# EAGLE board XibecaModule (EAGLE 9.6.2)
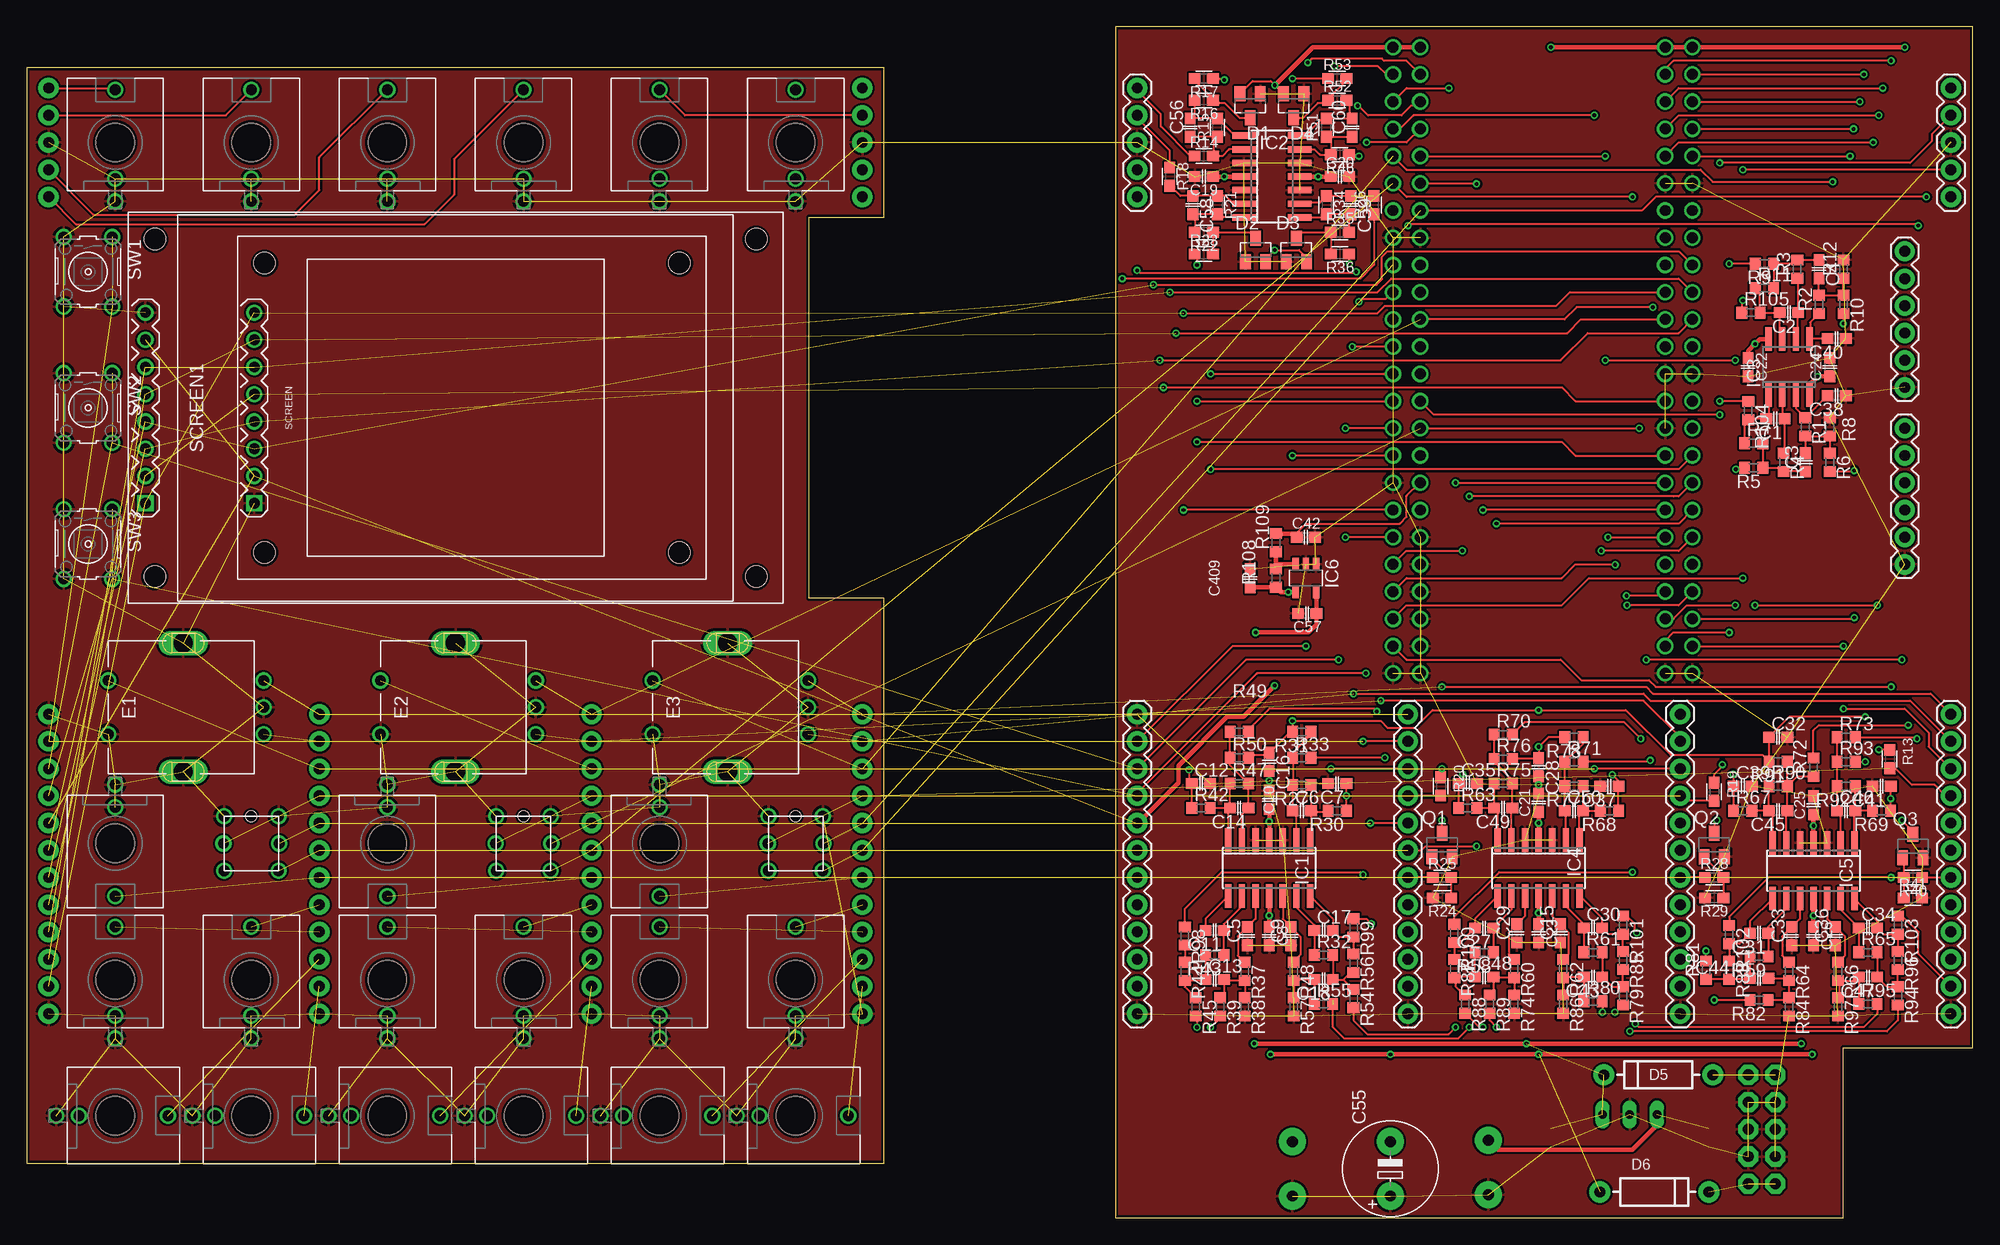
[diagram p2: board, top side]
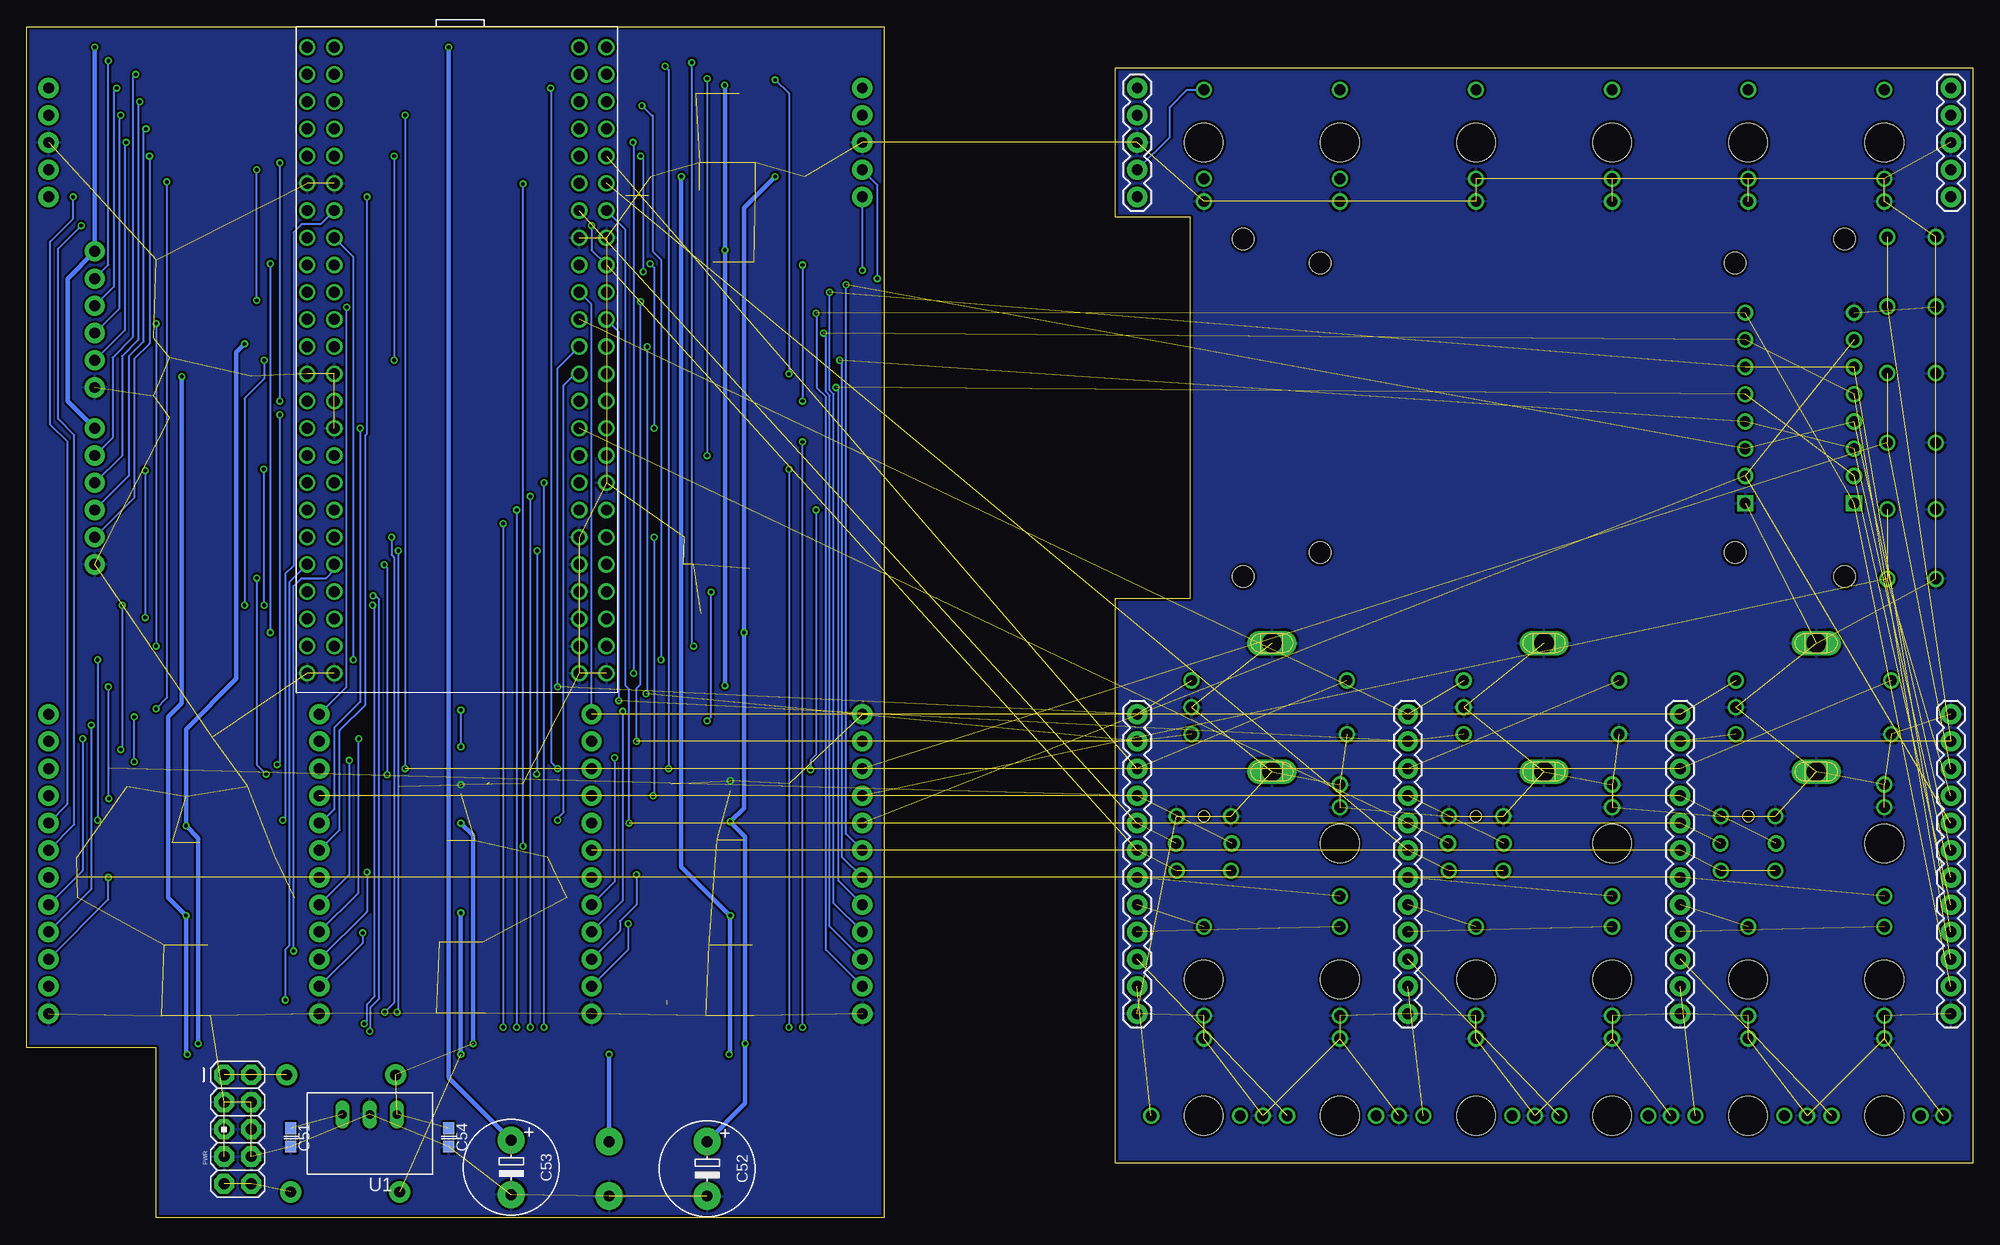
[diagram p3: board, bottom side, seen from below]

Size 181.61 x 111.12 mm. Coordinates in mm from the lower left corner, seen from the top.
Outline: 80.01,93.34 80.01,107.31 0,107.31 0,5.08 80.01,5.08 80.01,57.78 73.03,57.78 73.03,93.34 80.01,93.34
Outline: 101.6,111.12 101.6,0 169.54,0 169.54,15.88 181.61,15.88 181.61,111.12 101.6,111.12
Copper layers (1*16): Top 0.035mm / dielectric 1.5mm / Bottom 0.035mm
Design rules "Fusion_eagle_rule_v1.1": minimum track width 6mil, minimum drill 12mil, track to track 6mil, track to pad 6mil, pad to pad 6mil, via to via 6mil, smd to smd 0mil, copper to edge 10mil, drill to drill 10mil, minimum pad ring 10mil, minimum via ring 6mil, stop-mask expansion 2mil, vias tented up to drill 100mil, thermal gap 10mil
Net classes: 1 power: width 0.178 mm, drill 0.305 mm, clearance 0.178 mm to class 0, clearance 0.178 mm

## Footprints (pad centres in the part's own frame; a part is rotated, then mirrored left to right if it is on the bottom)
C0603 = smd 1.1 x 1: 1 -0.85,0; 2 0.85,0
E5-8,5 = drill 1.016 pad 2.54: + -2.54,0; - 2.54,0
THONKICONN = drill 1: P$1 0,-5.5; P$2 0,-3.38; P$3 0,4.92 | hole 3.6: 0,0
SOT23 = smd 1 x 1.4: 1 -0.95,-1.1; 2 0.95,-1.1; 3 0,1.1
DIODE-1N4001 = drill 1 pad 1.981: A -5.08,0; C 5.08,0
EC12E2424407 = drill 1: C 0,-7.5; PINA -2.5,-7.5; PINB 2.5,-7.5; SWITCH1 -2.5,7; SWITCH2 2.5,7 | drill 1.8 long: P$1 -6,0; P$2 6,0
SO14 = smd 0.6 x 2.2: 1 -3.81,-2.6; 2 -2.54,-2.6; 3 -1.27,-2.6; 4 0,-2.6; 5 1.27,-2.6; 6 2.54,-2.6; 7 3.81,-2.6; 8 3.81,2.6; 9 2.54,2.6; 10 1.27,2.6; 11 0,2.6; 12 -1.27,2.6; 13 -2.54,2.6; 14 -3.81,2.6
SO08 = smd 0.6 x 2.2: 1 -1.905,-2.6; 2 -0.635,-2.6; 3 0.635,-2.6; 4 1.905,-2.6; 5 1.905,2.6; 6 0.635,2.6; 7 -0.635,2.6; 8 -1.905,2.6
SOT23-5 = smd 0.6 x 1.2: 1 -0.95,-1.306; 2 0,-1.306; 3 0.95,-1.306; 4 0.95,1.306; 5 -0.95,1.306
1X05 = drill 1.016 pad 1.88: 1 0,0; 2 2.54,0; 3 5.08,0; 4 7.62,0; 5 10.16,0
1X06 = drill 1.016 pad 1.88: 1 0,0; 2 2.54,0; 3 5.08,0; 4 7.62,0; 5 10.16,0; 6 12.7,0
1X12 = drill 1.016 pad 1.88: 1 0,0; 2 2.54,0; 3 5.08,0; 4 7.62,0; 5 10.16,0; 6 12.7,0; 7 15.24,0; 8 17.78,0; 9 20.32,0; 10 22.86,0; 11 25.4,0; 12 27.94,0
AVR_ICSP = drill 1.016 pad 1.88 octagon: 1 -1.27,5.08; 2 1.27,5.08; 3 -1.27,2.54; 4 1.27,2.54; 5 -1.27,0; 6 1.27,0; 7 -1.27,-2.54; 8 1.27,-2.54; 9 -1.27,-5.08; 10 1.27,-5.08
R0603 = smd 1 x 1.1: 1 -0.85,0; 2 0.85,0
0603 = smd 1.1 x 1: 1 -0.85,0; 2 0.85,0
DISPLAY-TFT-240X320-2.0" = drill 1 square: 1 -8.89,28.93 | drill 1: 2 -6.35,28.93; 3 -3.81,28.93; 4 -1.27,28.93; 5 1.27,28.93; 6 3.81,28.93; 7 6.35,28.93; 8 8.89,28.93 | hole 2: -15.74,28.06; 15.74,28.06; 15.74,-28.06; -15.74,-28.06
DISPLAY-TFT-240X240-1.54" = drill 1 square: 1 -8.89,18.77 | drill 1: 2 -6.35,18.77; 3 -3.81,18.77; 4 -1.27,18.77; 5 1.27,18.77; 6 3.81,18.77; 7 6.35,18.77; 8 8.89,18.77 | hole 2: -13.5,17.81; 13.5,17.81; 13.5,-20.91; -13.5,-20.91
B3F-10XX = drill 1.016: 1 -3.251,2.261; 2 3.251,2.261; 3 -3.251,-2.261; 4 3.251,-2.261
PB6146L = drill 1: P1 -2.54,2.54; P2 2.54,2.54; P3 -2.54,-2.54; P4 2.54,-2.54; PL1 -2.6,0; PL2 2.6,0 | hole 1: 0,2.54
TSR-1-2450 = drill 0.8 long: 1 -2.54,0; 2 0,0; 3 2.54,0
NOCTUA = drill 1.016: 1 13.97,26.67; 2 11.43,26.67; 3 13.97,24.13; 4 11.43,24.13; 5 13.97,21.59; 6 11.43,21.59; 7 13.97,19.05; 8 11.43,19.05; 9 13.97,16.51; 10 11.43,16.51; 11 13.97,13.97; 12 11.43,13.97; 13 13.97,11.43; 14 11.43,11.43; 15 13.97,8.89; 16 11.43,8.89; 17 13.97,6.35; 18 11.43,6.35; 19 13.97,3.81; 20 11.43,3.81; 21 13.97,1.27; 22 11.43,1.27; 23 13.97,-1.27; 24 11.43,-1.27; 25 13.97,-3.81; 26 11.43,-3.81; 27 13.97,-6.35; 28 11.43,-6.35; 29 13.97,-8.89; 30 11.43,-8.89; 31 13.97,-11.43; 32 11.43,-11.43; 33 13.97,-13.97; 34 11.43,-13.97; 35 13.97,-16.51; 36 11.43,-16.51; 37 13.97,-19.05; 38 11.43,-19.05; 39 13.97,-21.59; 40 11.43,-21.59; 41 13.97,-24.13; 42 11.43,-24.13; 43 13.97,-26.67; 44 11.43,-26.67; 45 13.97,-29.21; 46 11.43,-29.21; 47 13.97,-31.75; 48 11.43,-31.75; 49 -11.43,-31.75; 50 -13.97,-31.75; 51 -11.43,-29.21; 52 -13.97,-29.21; 53 -11.43,-26.67; 54 -13.97,-26.67; 55 -11.43,-24.13; 56 -13.97,-24.13; 57 -11.43,-21.59; 58 -13.97,-21.59; 59 -11.43,-19.05; 60 -13.97,-19.05; 61 -11.43,-16.51; 62 -13.97,-16.51; 63 -11.43,-13.97; 64 -13.97,-13.97; 65 -11.43,-11.43; 66 -13.97,-11.43; 67 -11.43,-8.89; 68 -13.97,-8.89; 69 -11.43,-6.35; 70 -13.97,-6.35; 71 -11.43,-3.81; 72 -13.97,-3.81; 73 -11.43,-1.27; 74 -13.97,-1.27; 75 -11.43,1.27; 76 -13.97,1.27; 77 -11.43,3.81; 78 -13.97,3.81; 79 -11.43,6.35; 80 -13.97,6.35; 81 -11.43,8.89; 82 -13.97,8.89; 83 -11.43,11.43; 84 -13.97,11.43; 85 -11.43,13.97; 86 -13.97,13.97; 87 -11.43,16.51; 88 -13.97,16.51; 89 -11.43,19.05; 90 -13.97,19.05; 91 -11.43,21.59; 92 -13.97,21.59; 93 -11.43,24.13; 94 -13.97,24.13; 95 -11.43,26.67; 96 -13.97,26.67

## Placement (x,y rotation side)
C1  220p C0G  [C0603]  163.19,74.55 180 top
C2  220p C0G  [C0603]  164.47,84.45 180 top
C3  1n5  [C0603]  165.99,70.48 90 top
C4  1n5  [C0603]  167.26,88.52 270 top
C5  220p C0G  [C0603]  113.92,26.29 90 top
C6  220p C0G  [C0603]  119,37.97 0 top
C7  22n C0G  [C0603]  122.3,40.51 180 top
C8  100n  [C0603]  115.95,26.29 270 top
C9  220p C0G  [C0603]  117.98,26.29 90 top
C10  100n  [C0603]  115.95,38.99 90 top
C11  220p C0G  [C0603]  110.87,26.8 180 top
C12  22n C0G  [C0603]  109.6,40.51 0 top
C13  1n5  [C0603]  110.87,22.23 0 top
C14  220p C0G  [C0603]  113.16,38.23 180 top
C15  220p C0G  [C0603]  143.13,26.54 90 top
C16  100n  [C0603]  115.95,42.55 270 top
C17  220p C0G  [C0603]  121.03,26.8 0 top
C18  1n5  [C0603]  121.03,22.23 180 top
C19  100n  [C0603]  109.86,97.16 180 top
C20  100n  [C0603]  122.56,97.16 0 top
C21  100n  [C0603]  141.1,38.73 90 top
C22  100n  [C0603]  160.66,79.38 270 top
C23  100n  [C0603]  141.1,26.54 270 top
C24  100n  [C0603]  168.28,79.38 90 top
C25  100n  [C0603]  166.75,38.48 90 top
C26  100n  [C0603]  166.75,26.29 270 top
C27  220p C0G  [C0603]  136.02,27.05 180 top
C28  100n  [C0603]  141.1,42.04 270 top
C29  220p C0G  [C0603]  139.06,26.54 90 top
C30  220p C0G  [C0603]  146.18,27.05 0 top
C31  220p C0G  [C0603]  161.67,26.54 180 top
C32  100n  [C0603]  163.45,44.83 0 top
C33  220p C0G  [C0603]  164.72,26.29 90 top
C34  220p C0G  [C0603]  171.83,27.05 0 top
C35  22n C0G  [C0603]  134.49,40.51 0 top
C36  220p C0G  [C0603]  168.78,26.29 90 top
C37  22n C0G  [C0603]  147.7,40.26 180 top
C38  220p C0G  [C0603]  168.91,76.71 180 top
C39  22n C0G  [C0603]  160.15,40.26 0 top
C40  220p C0G  [C0603]  168.91,82.04 180 top
C41  22n C0G  [C0603]  173.1,40.26 180 top
C42  100n  [C0603]  119.38,63.5 0 top
C43  1n5  [C0603]  146.18,22.48 180 top
C44  1n5  [C0603]  161.67,22.35 0 top
C45  220p C0G  [C0603]  163.45,37.97 180 top
C46  220p C0G  [C0603]  169.8,37.97 0 top
C47  1n5  [C0603]  171.83,22.48 180 top
C48  1n5  [C0603]  136.02,22.48 0 top
C49  220p C0G  [C0603]  137.79,38.23 180 top
C50  220p C0G  [C0603]  144.4,37.97 0 top
C51  100n  [C0603]  156.97,7.49 270 bottom
C52  22u  [E5-8,5]  118.11,4.57 270 bottom
C53  22u  [E5-8,5]  136.4,4.7 270 bottom
C54  100n 16v  [C0603]  142.24,7.49 270 bottom
C55  22u  [E5-8,5]  127.25,4.57 90 top
C56  220p C0G  [C0603]  108.58,101.73 90 top
C57  100n  [C0603]  119.51,56.39 180 top
C58  220p C0G  [C0603]  108.84,94.49 270 top
C59  220p C0G  [C0603]  123.57,94.49 270 top
C60  220p C0G  [C0603]  123.7,101.73 90 top
C409  2u  [C0603]  114.17,59.69 90 top
CV1  THONKICONN  [THONKICONN]  8.26,100.33 0 top
CV2  THONKICONN  [THONKICONN]  20.95,100.33 0 top
CV3  THONKICONN  [THONKICONN]  33.66,100.33 0 top
CV4  THONKICONN  [THONKICONN]  46.35,100.33 0 top
D1  BAT54S  [SOT23]  114.17,103.76 180 top
D2  BAT54S  [SOT23]  114.68,90.3 0 top
D3  BAT54S  [SOT23]  118.49,90.3 0 top
D4  BAT54S  [SOT23]  118.24,103.76 180 top
D5  [DIODE-1N4001]  152.27,13.34 180 top
D6  [DIODE-1N4001]  151.89,2.41 0 top
E1  EC12E2424407  [EC12E2424407]  14.61,47.62 90 top
E2  EC12E2424407  [EC12E2424407]  40.01,47.62 90 top
E3  EC12E2424407  [EC12E2424407]  65.41,47.62 90 top
IC1  OPA1678  [SO14]  115.95,32.64 180 top
IC2  TL074  [SO14]  116.2,97.16 270 top
IC3  TL072D  [SO08]  164.47,79.38 0 top
IC4  OPA1678  [SO14]  141.1,32.64 180 top
IC5  OPA1678  [SO14]  166.75,32.38 180 top
IC6  LMV321ILT  [SOT23-5]  119.38,59.69 180 top
IN1  THONKICONN  [THONKICONN]  8.26,22.23 0 top
IN2  THONKICONN  [THONKICONN]  20.95,22.23 0 top
IN3  THONKICONN  [THONKICONN]  33.66,22.23 0 top
IN4  THONKICONN  [THONKICONN]  46.35,22.23 0 top
IN5  THONKICONN  [THONKICONN]  59.05,22.23 0 top
IN6  THONKICONN  [THONKICONN]  71.75,22.23 0 top
JP1  [1X05]  2.03,95.25 90 bottom
JP2  [1X05]  77.98,95.25 90 bottom
JP3  [1X06]  175.26,90.17 270 top
JP4  [1X06]  175.26,73.66 270 top
JP5  M12PTH  [1X12]  103.63,19.05 90 top
JP6  M12PTH  [1X12]  128.91,19.05 90 top
JP7  M12PTH  [1X12]  154.31,19.05 90 top
JP8  M12PTH  [1X12]  179.58,19.05 90 top
JP9  [1X05]  179.58,95.25 90 top
JP10  M12PTH  [1X12]  77.98,19.05 90 bottom
JP11  M12PTH  [1X12]  52.7,19.05 90 bottom
JP12  M12PTH  [1X12]  27.3,19.05 90 bottom
JP13  M12PTH  [1X12]  2.03,19.05 90 bottom
JP14  [1X05]  103.63,95.25 90 top
OUT1  THONKICONN  [THONKICONN]  59.05,100.33 0 top
OUT2  THONKICONN  [THONKICONN]  71.75,100.33 0 top
OUT3  THONKICONN  [THONKICONN]  8.26,9.53 270 top
OUT4  THONKICONN  [THONKICONN]  20.95,9.53 270 top
OUT5  THONKICONN  [THONKICONN]  33.66,9.53 270 top
OUT6  THONKICONN  [THONKICONN]  46.35,9.53 270 top
OUT7  THONKICONN  [THONKICONN]  59.05,9.53 270 top
OUT8  THONKICONN  [THONKICONN]  71.75,9.53 270 top
PWR  M05X2PTH  [AVR_ICSP]  161.93,8.26 0 bottom
Q1  BC846  [SOT23]  132.08,34.8 0 top
Q2  BC846  [SOT23]  157.48,34.8 0 top
Q3  BC846  [SOT23]  176.02,34.67 0 top
R1  560R  [R0603]  165.99,73.79 270 top
R2  560R  [R0603]  167.26,85.22 90 top
R3  560R  [R0603]  165.23,88.52 90 top
R4  560R  [R0603]  163.96,70.48 270 top
R5  10k  [R0603]  161.16,69.98 180 top
R6  10k  [R0603]  168.28,70.48 270 top
R7  27k  [R0603]  161.16,72.26 0 top
R8  27k  [R0603]  168.28,73.79 90 top
R9  10k  [R0603]  162.18,89.03 180 top
R10  10k  [R0603]  169.54,85.22 270 top
R11  27k  [R0603]  162.18,86.74 0 top
R12  27k  [R0603]  169.54,88.52 90 top
R13  560R  [0603]  173.86,42.8 270 top
R14  100k  [0603]  109.86,99.06 0 top
R15  33k  [0603]  111.12,101.73 90 top
R16  1k  [0603]  109.86,104.27 180 top
R17  100R  [0603]  109.86,106.3 180 top
R18  100k  [0603]  106.68,97.16 270 top
R19  560R  [0603]  157.48,39.75 270 top
R20  560R  [0603]  131.95,40.26 270 top
R21  33k  [0603]  111.12,94.49 270 top
R22  1k  [0603]  109.86,91.95 180 top
R23  100R  [0603]  109.86,89.92 0 top
R24  1M  [0603]  132.08,29.84 180 top
R25  100k  [0603]  132.08,31.75 0 top
R26  100k  [0603]  125.73,94.49 90 top
R27  11k  [R0603]  119,40.39 180 top
R28  100k  [0603]  157.48,31.75 0 top
R29  1M  [0603]  157.48,29.84 180 top
R30  47R  [R0603]  122.3,37.97 180 top
R31  11k  [R0603]  119,45.34 180 top
R32  560R  [R0603]  121.03,24.51 0 top
R33  100k  [R0603]  119,42.93 0 top
R34  33k  [0603]  121.28,94.49 270 top
R35  1k  [0603]  122.56,91.95 0 top
R36  100R  [0603]  122.56,89.92 180 top
R37  560R  [R0603]  113.67,22.99 270 top
R38  27k  [R0603]  113.67,19.68 270 top
R39  10k  [R0603]  111.38,19.68 270 top
R40  100k  [0603]  176.02,31.75 180 top
R41  1M  [0603]  176.02,29.84 0 top
R42  47R  [R0603]  109.6,38.23 0 top
R43  560R  [R0603]  110.87,24.51 180 top
R44  27k  [R0603]  108.08,22.99 270 top
R45  10k  [R0603]  109.09,19.68 270 top
R46  100k  [0603]  122.56,99.19 180 top
R47  11k  [R0603]  113.16,40.51 0 top
R48  560R  [R0603]  118.24,22.99 270 top
R49  100k  [R0603]  113.16,45.34 0 top
R50  11k  [R0603]  113.16,42.93 0 top
R51  33k  [0603]  121.28,101.73 90 top
R52  1k  [0603]  122.3,104.27 0 top
R53  100R  [0603]  122.3,106.3 0 top
R54  10k  [R0603]  123.83,20.45 270 top
R55  10k  [R0603]  121.03,19.94 0 top
R56  27k  [R0603]  123.83,23.75 270 top
R57  27k  [R0603]  118.24,19.68 270 top
R58  560R  [R0603]  136.02,24.77 180 top
R59  560R  [R0603]  161.67,24.38 180 top
R60  560R  [R0603]  138.81,23.24 270 top
R61  560R  [R0603]  146.18,24.77 0 top
R62  560R  [R0603]  143.38,23.24 270 top
R63  47R  [R0603]  134.49,38.23 0 top
R64  560R  [R0603]  164.47,22.99 270 top
R65  560R  [R0603]  171.83,24.77 0 top
R66  560R  [R0603]  169.04,22.99 270 top
R67  47R  [R0603]  160.15,37.97 0 top
R68  47R  [R0603]  147.7,37.97 180 top
R69  47R  [R0603]  173.1,37.97 180 top
R70  100k  [R0603]  137.79,45.09 0 top
R71  100k  [R0603]  144.4,42.55 0 top
R72  100k  [R0603]  166.75,42.04 90 top
R73  100k  [R0603]  169.8,44.83 0 top
R74  27k  [R0603]  138.81,19.94 270 top
R75  11k  [R0603]  137.79,40.51 0 top
R76  11k  [R0603]  137.79,42.8 0 top
R77  11k  [R0603]  144.4,40.26 180 top
R78  11k  [R0603]  144.4,44.83 180 top
R79  10k  [R0603]  148.97,20.7 270 top
R80  10k  [R0603]  146.18,20.19 0 top
R81  10k  [R0603]  156.72,23.11 90 top
R82  10k  [R0603]  161.67,20.32 180 top
R83  27k  [R0603]  158.88,23.11 270 top
R84  27k  [R0603]  164.47,19.68 270 top
R85  27k  [R0603]  148.97,24 270 top
R86  27k  [R0603]  143.38,19.94 270 top
R87  27k  [R0603]  133.22,23.24 270 top
R88  10k  [R0603]  134.24,19.94 270 top
R89  10k  [R0603]  136.53,19.94 270 top
R90  11k  [R0603]  163.45,40.26 0 top
R91  11k  [R0603]  163.45,42.55 180 top
R92  11k  [R0603]  169.8,40.26 180 top
R93  11k  [R0603]  169.8,42.55 0 top
R94  10k  [R0603]  174.62,20.7 270 top
R95  10k  [R0603]  171.83,19.94 0 top
R96  27k  [R0603]  174.62,24 270 top
R97  27k  [R0603]  169.04,19.68 270 top
R98  100R  [R0603]  108.08,26.29 270 top
R99  100R  [R0603]  123.83,27.05 270 top
R100  100R  [R0603]  133.22,26.54 270 top
R101  100R  [R0603]  148.97,27.3 270 top
R102  100R  [R0603]  158.88,26.42 270 top
R103  100R  [R0603]  174.62,27.3 270 top
R104  100R  [R0603]  160.66,75.31 270 top
R105  100R  [R0603]  160.91,84.45 0 top
R108  1M  [R0603]  116.59,59.69 90 top
R109  1M  [R0603]  116.59,62.99 90 top
SCREEN  DISPLAY-TFT-240X2402.0  [DISPLAY-TFT-240X320-2.0"]  40.01,75.56 90 top
SCREEN1  DISPLAY-TFT-240X2401.54  [DISPLAY-TFT-240X240-1.54"]  40.01,75.56 90 top
SW1  [B3F-10XX]  5.71,88.27 270 top
SW2  [B3F-10XX]  5.71,75.56 270 top
SW3  [B3F-10XX]  5.71,62.87 270 top
SW4  PB6146L  [PB6146L]  20.95,34.92 0 top
SW5  PB6146L  [PB6146L]  46.35,34.92 0 top
SW6  PB6146L  [PB6146L]  71.75,34.92 0 top
TR1  THONKICONN  [THONKICONN]  8.26,34.92 180 top
TR2  THONKICONN  [THONKICONN]  33.66,34.92 180 top
TR3  THONKICONN  [THONKICONN]  59.05,34.92 180 top
U1  [TSR-1-2450]  149.61,9.65 180 bottom
U$2  NOCTUA2NOCTUA2  [NOCTUA]  141.48,82.55 0 bottom

## Tracks (layer width: path | path; a pad name or v marks a point on that pad's centre or on a via)
+3V3  (via drill 0.35)  (3 unrouted)
  Top 0.203: D2.2 115.63,89.47 v116.46,90.3 118.75,90.3 119.44,89.6 D3.2 | D1.2 114.41,106.05 116.1,106.05 v116.47,105.67 D4.2
  Top 0.406: v116.46,49.66 113.54,46.74 112.01,46.74 107.47,42.19 107.47,40.61 103.69,36.83 JP5.8 | U$2.2 U$2.1 120.02,109.22 v116.47,105.67
  Bottom 0.203: 116.46,105.66 v116.47,105.67
  Bottom 0.406: 116.46,105.66 v116.46,90.3 v116.46,49.66
+5V  (via drill 0.35)  (1 unrouted)
  Top 0.406: v175.26,109.22 U$2.96 U$2.95 v142.24,109.22 | U1.3 152.15,8.64 149.86,6.35 137.29,6.35 C53.+
  Bottom 0.406: v175.26,109.22 JP3.1 177.8,87.63 177.8,76.2 JP4.1 | C53.+ 142.24,13.08 v142.24,109.22
+12V  (via drill 0.35)  (3 unrouted)
  Top 0.406: IC1.4 v115.95,36.96 C10.1 | C21.1 v141.1,36.83 IC4.4 | IC5.4 v166.75,36.58 C25.1 | v114.55,16.26 v139.95,16.26 v165.61,16.26 | IC3.8 161.73,81.97 v161.29,81.53 160.66,80.9 C22.1 | IC2.4 v111.76,97.16 C19.1 | v114.68,54.61 119.63,54.61 120.36,55.33 C57.1 120.36,58.36 IC6.5
  Bottom 0.406: C52.+ 114.55,10.67 v114.55,16.26 114.55,35.56 v115.95,36.96 114.68,38.23 v114.68,54.61 114.68,94.23 v111.76,97.16 | v165.61,16.26 165.61,35.43 v166.75,36.58 166.75,45.59 162.05,50.29 162.05,80.77 v161.29,81.53 | v141.1,36.83 139.95,35.69 v139.95,16.26
-12V  (via drill 0.35)  (1 unrouted)
  Top 0.406: IC1.11 v115.95,28.19 C8.1 | IC4.11 v141.1,28.45 C23.1 | IC5.11 v166.75,28.19 C26.1 | v166.62,15.24 v141.1,15.24 v127.25,15.24 v116.08,15.24 | C24.1 167.17,78.53 v167.13,78.49 166.37,77.72 IC3.4 | IC2.11 v120.52,97.16 C20.1
  Bottom 0.406: C55.- v127.25,15.24 | v166.62,15.24 166.75,15.37 v166.75,28.19 168.4,29.84 168.4,46.74 167.13,48.01 v167.13,78.49 | v141.1,28.45 v141.1,15.24 | v116.08,15.24 115.95,15.37 v115.95,28.19 120.52,32.77 v120.52,97.16
ADC1  (via drill 0.35)
  Top 0.203: R17.1 111.63,106.3 v111.76,106.17 | v110.49,78.74 U$2.25
  Bottom 0.203: v111.76,106.17 110.49,104.9 v110.49,78.74
ADC2  (via drill 0.35)
  Top 0.203: R23.1 109.22,89.7 v109.22,88.9 | v109.22,76.2 U$2.27
  Bottom 0.203: v109.22,88.9 v109.22,76.2
ADC3  (via drill 0.35)
  Top 0.203: R36.1 123.41,89.07 v123.44,89.03 | U$2.29 v123.06,73.66
  Bottom 0.203: v123.44,89.03 123.06,88.65 v123.06,73.66
ADC4  (via drill 0.35)
  Top 0.203: U$2.31 v118.11,71.12 | R53.1 v118.11,106.3
  Bottom 0.203: v118.11,106.3 v118.11,71.12
ADCREF
  Top 0.203: C42.1 118.53,63.92 119.38,64.77 128.14,64.77 128.78,65.41 128.78,67.35 130.01,68.58 U$2.34
  Top 0.406: R109.2 118.19,63.84 C42.1
ADCREF_NEGATIVE  (via drill 0.35)
  Top 0.203: 117.94,45.34 R31.2 118.15,45.59 | 118.15,45.59 118.15,46.32 v118.11,46.35 126.36,46.35 127,45.72 129.54,45.72 131.19,47.37 v141.1,47.37 149.22,47.37 153.42,43.18 161.96,43.18 R91.2 C32.1 164.5,46.74 v171.58,46.74 | R93.2 v171.58,42.55 | R76.2 138.73,42.89 C28.1 v141.1,43.94 141.99,44.83 R78.2 | R50.2 114.3,43.22 115.82,43.22 C16.1 118.15,45.59
  Top 0.406: IC6.4 v117.73,58.38 117.04,58.38 R108.1 C409.1
  Bottom 0.203: v118.11,46.35 117.73,46.74 v117.73,58.38 | v171.58,42.55 v171.58,46.74 | v141.1,47.37 v141.1,43.94
AIN1P  (via drill 0.35)
  Top 0.203: R42.1 C12.1 108.46,40.81 v108.46,41.78 | U$2.35 v107.95,66.04
  Bottom 0.203: v107.95,66.04 107.95,43.18 108.46,42.67 v108.46,41.78
AIN2P  (via drill 0.35)
  Top 0.203: R30.1 v123.15,39.37 C7.1 | U$2.37 v123.06,63.5
  Bottom 0.203: v123.06,63.5 123.06,39.46 v123.15,39.37
AIN3P  (via drill 0.35)
  Top 0.203: R63.1 C35.1 134.04,40.91 v134.04,41.4 | U$2.39 128.78,62.23 v133.99,62.23
  Bottom 0.203: v133.99,62.23 133.99,41.46 v134.04,41.4
AIN4P  (via drill 0.35)
  Top 0.203: R68.1 C37.1 148.55,40.76 v147.98,41.33 | U$2.41 128.78,59.69 143.26,59.69 144.53,60.96 147.96,60.96 147.99,60.93 v148.24,60.93
  Bottom 0.203: v148.24,60.93 147.98,60.67 v147.98,41.33
AIN5P  (via drill 0.35)
  Top 0.203: R67.1 C39.1 159.26,40.3 v159.26,41.4 | U$2.43 128.78,57.15 143.26,57.15 145.8,59.69 v160.15,59.69
  Bottom 0.203: v160.15,59.69 160.15,42.29 v159.26,41.4
AIN6P  (via drill 0.35)
  Top 0.203: R69.1 v173.95,39.12 C41.1 | U$2.45 128.78,52.07 143.17,52.07 145.07,50.16 151.38,50.16 152.02,49.53 v173.99,49.53
  Bottom 0.203: v173.99,49.53 173.99,39.16 v173.95,39.12
AOUT1_N  (via drill 0.35)
  Top 0.203: U$2.66 154.18,69.85 v110.49,69.85 | v110.49,17.78 111.38,18.67 R39.2
  Bottom 0.203: v110.49,69.85 v110.49,17.78
AOUT1_P  (via drill 0.35)
  Top 0.203: R45.2 109.22,18.71 v109.22,17.78 | v109.22,72.39 143.26,72.39 144.53,71.12 U$2.65
  Bottom 0.203: v109.22,17.78 v109.22,72.39
AOUT2_N  (via drill 0.35)  (1 unrouted)
  Top 0.203: U$2.64 154.18,67.31 153.67,67.31 v134.62,67.31 | v134.62,17.78 133.55,16.71 133.35,16.71 122.99,16.71 121.92,17.78 121.92,20.32
  Bottom 0.203: v134.62,67.31 v134.62,17.78
AOUT2_P  (via drill 0.35)
  Top 0.203: R54.2 123.83,18.41 125.09,17.14 132.72,17.14 v133.35,17.78 | v133.35,68.58 U$2.63
  Bottom 0.203: v133.35,17.78 v133.35,68.58
AOUT3_N  (via drill 0.35)
  Top 0.203: U$2.62 154.18,64.77 v137.16,64.77 | v137.16,17.78 136.53,18.41 R89.2
  Bottom 0.203: v137.16,64.77 v137.16,17.78
AOUT3_P  (via drill 0.35)
  Top 0.203: U$2.61 v135.89,66.04 | v135.89,17.78 135.55,17.78 R88.2
  Bottom 0.203: v135.89,66.04 v135.89,17.78
AOUT4_N  (via drill 0.35)
  Top 0.203: R80.2 147.03,19.22 v147.07,19.18 | U$2.60 154.18,62.23 v146.94,62.23
  Bottom 0.203: v147.07,19.18 146.94,19.3 v146.94,62.23
AOUT4_P  (via drill 0.35)
  Top 0.203: R79.2 148.3,19.18 v148.21,19.18 | v147.57,63.5 U$2.59
  Bottom 0.203: v147.57,63.5 147.57,61.85 147.32,61.59 147.32,20.07 v148.21,19.18
AOUT5_N  (via drill 0.35)
  Top 0.203: R82.2 v157.48,20.32
  Bottom 0.203: v157.48,20.32 157.48,25.02 157.1,25.4 157.1,59.31 U$2.58
AOUT5_P  (via drill 0.35)
  Top 0.203: R81.2 v156.72,24.89
  Bottom 0.203: U$2.57 152.91,60.45 153.67,59.69 155.96,59.69 156.72,58.93 v156.72,24.89
AOUT6_N  (via drill 0.35)
  Top 0.203: R95.2 172.68,19.09 172.72,19.05 171.45,17.78 150.44,17.78 v150.11,18.11 | U$2.56 154.18,57.15 v149.35,57.15
  Bottom 0.203: v150.11,18.11 149.86,18.36 149.86,19.94 149.12,20.68 149.12,56.92 v149.35,57.15
AOUT6_P  (via drill 0.35)
  Top 0.203: R94.2 174.62,18.41 173.61,17.4 v149.61,17.4 | U$2.55 152.53,58.04 v149.3,58.04
  Bottom 0.203: v149.61,17.4 149.5,17.5 149.5,19.66 148.72,20.45 148.72,57.71 149.05,58.04 v149.3,58.04
AOUT7_N  (via drill 0.35)
  Top 0.203: R6.2 170.47,69.64 v170.56,69.72 | U$2.54 170.43,55.88 v170.56,56.01
  Bottom 0.203: v170.56,69.72 v170.56,56.01
AOUT7_P  (via drill 0.35)
  Top 0.203: U$2.53 153.67,55.88 154.94,57.15 v159.46,57.15 | v159.51,69.85 159.64,69.98 R5.2
  Bottom 0.203: v159.46,57.15 159.46,69.8 v159.51,69.85
AOUT8_N  (via drill 0.35)
  Top 0.203: R10.2 v169.54,83.44 | U$2.52 v169.54,53.34
  Bottom 0.203: v169.54,83.44 v169.54,53.34
AOUT8_P  (via drill 0.35)
  Top 0.203: U$2.51 152.91,53.85 153.67,54.61 v158.88,54.61 | R9.2 v158.88,89.03
  Bottom 0.203: v158.88,89.03 v158.88,54.61
CV1
  Top 0.203: JP14.5 103.63,105.19 105.84,102.98 105.84,101.84 108.62,99.06 R14.1
CV2
  Top 0.203: JP14.4 103.63,102.62 106.68,99.57 R18.1
CV3  (via drill 0.35)
  Top 0.203: R26.1 125.73,88.9 124.46,87.63 v102.23,87.63
  Bottom 0.203: JP14.2 102.23,96.39 v102.23,87.63
CV4  (via drill 0.35)
  Top 0.203: R46.1 124.21,99.19 v124.33,99.06 | v124.08,88.27 123.95,88.14 103.89,88.14 v103.63,88.39
  Bottom 0.203: v124.33,99.06 124.08,98.81 v124.08,88.27 | v103.63,88.39 JP14.1
ENC1A  (via drill 0.35)  (2 unrouted)
  Top 0.203: JP6.11 v124.71,44.45 | v124.33,85.47 124.61,85.75 126.85,85.75 127.46,86.36 U$2.19
  Bottom 0.203: v124.71,44.45 124.71,49.4 124.33,49.78 v124.33,85.47
ENC1B  (2 unrouted)
  Bottom 0.203: JP6.12 128.91,85.22 U$2.20
ENC1SW  (via drill 0.35)  (2 unrouted)
  Top 0.203: JP6.10 v121.72,41.91 | v122.05,107.44 126.11,107.44 126.87,106.68 U$2.3
  Bottom 0.203: v121.72,41.91 121.72,107.11 v122.05,107.44
ENC2A  (via drill 0.35)  (2 unrouted)
  Top 0.203: JP7.11 154.31,44.83 150.88,48.26 v126.36,48.26
  Bottom 0.203: U$2.21 126.36,82.68 v126.36,48.26
ENC2B  (via drill 0.35)  (2 unrouted)
  Top 0.203: v151.76,84.96 144.65,84.96 143.51,83.82 U$2.22
  Bottom 0.203: JP7.12 151.76,49.53 v151.76,84.96
ENC2SW  (via drill 0.35)  (2 unrouted)
  Top 0.203: JP7.10 v146.3,41.91 | v146.3,102.87 129.41,102.87 128.14,101.6 U$2.7
  Bottom 0.203: v146.3,102.87 v146.3,41.91
ENC3A  (via drill 0.35)  (2 unrouted)
  Top 0.203: U$2.23 v123.7,81.28 | v123.83,48.9 150.88,48.9 151.51,48.26 175.77,48.26 JP8.11
  Bottom 0.203: v123.7,81.28 123.7,49.02 v123.83,48.9
ENC3B  (via drill 0.35)  (2 unrouted)
  Top 0.203: v132.08,49.53 151.13,49.53 151.76,48.9 177.67,48.9 JP8.12
  Bottom 0.203: v132.08,49.53 132.08,79.25 U$2.24
ENC3SW  (via drill 0.35)  (2 unrouted)
  Top 0.203: U$2.9 128.78,97.79 156.21,97.79 157.35,96.65 v168.53,96.65 | v169.54,47.5 175.26,47.5 177.5,45.26 177.5,43.96 179.54,41.91 JP8.10
  Bottom 0.203: v168.53,96.65 168.53,48.51 v169.54,47.5
GND  (via drill 0.35)  (162 unrouted)
  Top 0.203: C28.2 v141.1,40.39 C21.2 | C16.2 v115.95,40.77 C10.2
  pour Top (isolate 0.2): -2.24,123.83 85.65,123.83 85.65,-3.17 -2.24,-3.17
  pour Bottom (isolate 0.2): -7.92,118.75 83.34,118.75 83.34,-8.26 -7.92,-8.26
  pour Bottom (isolate 0.2): 94.95,118.75 186.21,118.75 186.21,-8.26 94.95,-8.26
  pour Top (isolate 0.2): 99.36,123.83 199.39,123.83 199.39,-3.17 99.36,-3.17
IN1  (via drill 0.35)
  Top 0.203: v125.98,47.24 125.73,47.5 115.95,47.5 114.01,45.55 R49.2
  Bottom 0.203: v125.98,47.24 125.98,29.59 JP6.4
IN2  (via drill 0.35)
  Top 0.203: v126.75,42.93 R33.2
  Bottom 0.203: JP6.5 126.75,31.37 v126.75,42.93
IN3  (via drill 0.35)
  Top 0.203: v150.62,44.7 149.1,46.23 139.79,46.23 R70.2
  Bottom 0.203: v150.62,44.7 150.68,44.65 150.68,30.3 JP7.4
IN4  (via drill 0.35)
  Top 0.203: R71.2 151.38,42.55 v151.51,42.67
  Bottom 0.203: v151.51,42.67 151.51,32 JP7.5
IN5  (via drill 0.35)
  Top 0.203: R72.2 166.75,45.47 167.26,45.97 v175.59,45.97
  Bottom 0.203: v175.59,45.97 175.59,30.66 JP8.4
IN6  (via drill 0.35)
  Top 0.203: R73.2 176.28,44.83 v176.4,44.7
  Bottom 0.203: v176.4,44.7 176.4,32.38 JP8.5
LEDSW4  (via drill 0.35)
  Top 0.203: U$2.5 128.78,105.41 v132.72,105.41 | v132.08,41.91 132.08,41.24 R20.1
  Bottom 0.203: v132.72,105.41 132.66,105.36 132.66,42.49 v132.08,41.91
LEDSW4A  (2 unrouted)
  Top 0.203: R20.2 131.91,39.37 JP6.9
LEDSW4C  (via drill 0.35)  (2 unrouted)
  Top 0.203: JP6.8 v125.4,36.83
  Bottom 0.203: v125.4,36.83 125.4,49.33 125.73,49.66 125.73,92.2 U$2.13
LEDSW5  (via drill 0.35)
  Top 0.203: R19.1 157.48,41.36 158.24,42.12 v158.24,42.29 | v157.99,74.93 131.32,74.93 U$2.28
  Bottom 0.203: v157.99,74.93 157.99,42.55 v158.24,42.29
LEDSW5A  (2 unrouted)
  Top 0.203: R19.2 154.77,38.9 JP7.9
LEDSW5C  (via drill 0.35)  (2 unrouted)
  Top 0.203: U$2.30 v150.5,73.66
  Bottom 0.203: JP7.8 154.18,36.83 152.91,38.1 152.91,45.72 150.5,48.13 v150.5,73.66
LEDSW6  (via drill 0.35)
  Top 0.203: R13.1 172.89,43.65 v172.85,43.69 | U$2.10 v147.32,99.06 | v147.32,80.01 v159.46,80.01 | v161.29,57.15 v172.72,57.15
  Bottom 0.203: v172.85,43.69 172.72,43.81 v172.72,57.15 | v147.32,99.06 v147.32,80.01 | v159.46,80.01 159.46,78.29 161.29,76.45 v161.29,57.15
LEDSW6A  (2 unrouted)
  Top 0.203: JP8.9 179.07,39.37 178.05,40.39 175.93,40.39 174.37,41.95 R13.2
LEDSW6C  (via drill 0.35)  (2 unrouted)
  Top 0.203: v177.29,95.25 152.02,95.25 150.75,93.98 U$2.14
  Bottom 0.203: JP8.8 177.8,38.61 177.8,72.39 179.43,74.02 179.43,91.08 177.29,93.22 v177.29,95.25
N$1
  Top 0.203: IC1.14 121.88,27.92 C17.2 122.48,26.2 R99.2 R56.1
N$2
  Top 0.203: R57.1 R48.2 118.33,22.23 C18.2 R55.1
N$3
  Top 0.203: R32.2 C18.1 122.9,22.23 | R54.1 122.9,22.23 | R56.2 123.57,22.9 122.9,22.23
N$4
  Top 0.203: R27.1 C6.2 119.85,37.85 | 119.85,37.85 119.85,35.33 IC1.1 | R30.2 121.32,37.85 119.85,37.85
N$5
  Top 0.203: IC1.13 118.49,29 120.18,27.3 C17.1 R32.1
N$6
  Top 0.203: IC1.2 118.49,37.63 C6.1 R27.2 R33.1 118.15,43.38 119.85,45.09 R31.1
N$7  (2 unrouted)
N$8
  Top 0.203: IC1.12 117.22,27.9 C9.2 117.98,27.1 118.86,26.22 118.86,24.53 118.24,23.9 R48.1
N$9  (2 unrouted)
N$10
  Top 0.203: IC5.14 172.68,27.66 C34.2 173.28,26.45 R103.2 R96.1
N$11
  Top 0.203: R89.1 136.87,21.13 C48.2 136.96,22.39 R60.2 R74.1
N$12
  Top 0.203: R58.2 C48.1 133.44,22.48 133.35,22.39 R87.2 133.35,22.26 133.35,21.59 134.15,20.79 R88.1
N$13
  Top 0.203: IC4.9 138.56,28.74 C27.1 R58.1
N$14
  Top 0.203: IC4.10 139.83,28.16 C29.2 139.06,27.3 138.31,26.55 138.31,24.59 R60.1
N$15
  Top 0.203: IC4.8 135.17,27.92 C27.2 133.81,25.69 R100.2 R87.1
N$16
  Top 0.203: R85.1 R101.2 147.62,26.45 C30.2 147.03,27.94 144.93,30.04 IC4.14
N$17
  Top 0.203: IC4.7 137.29,37.88 C49.2 | C49.2 R75.1 | C49.2 R63.2
N$18  (1 unrouted)
  Top 0.203: IC4.6 138.56,38.14 C49.1 R75.2 | 138.43,40.64 138.43,41.06 136.94,42.55 R76.1 R70.1
N$19  (1 unrouted)
N$20
  Top 0.203: IC4.1 144.91,37.63 C50.2 | C50.2 R68.2 | C50.2 R77.1
N$21
  Top 0.203: IC4.2 143.64,37.88 C50.1 R77.2 R71.1 145.25,44.24 R78.1
N$22
  Top 0.203: IC5.8 160.82,27.66 C31.2 159.84,25.57 R102.2 R83.1
N$23
  Top 0.203: R80.1 C43.2 143.47,22.48 R62.2 R86.1
N$24
  Top 0.203: R61.2 C43.1 147.96,21.55 R79.1 R85.2
N$25
  Top 0.203: IC4.13 143.64,29.08 145.33,27.39 C30.1 R61.1
N$26
  Top 0.203: IC4.12 142.37,28.16 C15.2 143.88,26.64 143.88,24.59 R62.1
N$27
  Top 0.406: R108.2 116.59,60.96 | 116.59,60.96 R109.1 | IC6.3 118.39,60.96 116.59,60.96
N$28
  Top 0.203: IC3.1 162.56,74.76 C1.2 160.74,74.55 R104.2 160.31,74.12 R7.1
N$29
  Top 0.203: C3.2 R1.2 R8.1 R6.1
N$30
  Top 0.203: Q1.1 131.13,33.55 R25.2 R24.1
N$31
  Top 0.203: C3.1 165.35,69.64 | 165.35,69.64 R4.2 | R7.2 R5.1 165.01,69.98 165.35,69.64
N$32
  Top 0.203: IC3.7 163.62,82.19 C2.2 161.8,84.45 | R105.2 161.8,84.45 | R11.1 161.71,86.36 161.71,84.54 161.8,84.45
N$33  (1 unrouted)
N$34  (1 unrouted)
N$35
  Top 0.203: C44.2 164.25,22.35 R64.2 R84.1 164.25,20.32 R82.1
N$36
  Top 0.203: R59.2 C44.1 160.73,22.26 R83.2 R81.1
N$37
  Top 0.203: IC5.9 164.21,28.83 162.52,27.14 C31.1 R59.1
N$38
  Top 0.203: IC5.10 165.48,27.9 C33.2 163.83,26.25 163.83,24.47 R64.1
N$39
  Top 0.203: IC1.8 110.02,27.92 C11.2 108.66,25.44 R98.2 R44.1
N$40
  Top 0.203: Q2.1 158.33,31.9 R28.2 R29.1
N$41
  Top 0.203: IC5.7 162.94,37.63 C45.2 | C45.2 R67.2 | C45.2 R90.1
N$42
  Top 0.203: IC5.6 164.21,37.88 C45.1 R90.2 | R90.2 R91.1 | R90.2 165.23,41.19 R72.1
N$43  (1 unrouted)
N$44
  Top 0.203: IC5.1 170.56,37.88 C46.2 | R69.2 C46.2 | C46.2 R92.1
N$45
  Top 0.203: IC5.2 169.29,37.63 C46.1 R92.2 R93.1 R73.1
N$46  (1 unrouted)
N$47
  Top 0.203: C47.2 170.98,22.35 | 170.98,22.35 R95.1 | R97.1 169.16,20.54 169.16,22.01 R66.2 170.77,22.14 170.98,22.35
N$48
  Top 0.203: R65.2 C47.1 173.61,21.55 R94.1 R96.2
N$49
  Top 0.203: IC5.13 169.29,28.74 C34.1 R65.1
N$50
  Top 0.203: IC5.12 168.02,27.9 C36.2 169.67,26.25 169.67,24.47 R66.1
N$51  (1 unrouted)
N$52
  Top 0.203: IC2.6 112.65,94.61 111.89,95.38 111.16,95.38 R21.1 C58.1 107.65,95.34 R18.2
N$54
  Top 0.203: JP2.4 61.44,102.87 OUT1.P$3
N$55
  Bottom 0.203: JP2.2 74.93,100.84 74.93,103.63 73.31,105.25 OUT2.P$3
N$57
  Top 0.203: C56.1 R15.1 110.74,100.5 110.74,99.06 | IC2.2 112.21,99.69 111.57,99.06 110.74,99.06 | 110.74,99.06 R14.2
N$58  (1 unrouted)
N$59
  Top 0.203: Q3.1 175.17,33.47 R40.2 R41.1
N$60
  Top 0.203: IC3.2 163.83,74.76 C1.1 164.04,71.42 R4.1
N$61
  Top 0.203: IC3.3 165.1,75.53 R1.1 166.77,75.42 166.78,75.42 166.92,75.57 C38.2
N$62  (1 unrouted)
N$63
  Top 0.203: C4.2 R2.2 R10.1 R12.1
N$64
  Top 0.203: R11.2 162.94,87.08 163.03,87.17 R9.1 164.88,89.03 R3.2 C4.1
N$65
  Top 0.203: IC3.6 165.27,82.15 165.27,84.5 C2.1 165.31,87.58 R3.1
N$66
  Top 0.203: IC3.5 166.44,82.04 | 166.44,82.04 C40.2 | R2.1 166.44,83.55 166.44,82.04
N$67  (1 unrouted)
N$68
  Top 0.203: IC2.1 112.74,100.97 R15.2 C56.2 109,103 R16.2
N$69
  Top 0.203: D1.3 113.16,102.66 111.8,104.01 110.96,104.01 R16.1 110.7,104.39 109,106.09 R17.2
N$70
  Top 0.203: IC2.7 111.42,93.34 R21.2 C58.2 109,93.47 R22.2
N$71
  Top 0.203: D2.3 114.13,91.95 R22.1 R23.2
N$72  (1 unrouted)
  Top 0.203: IC2.9 118.93,94.74 120.69,94.74 R34.1 C59.1
N$73
  Top 0.203: IC2.8 120.99,93.34 R34.2 C59.2 123.41,93.47 R35.2
N$74
  Top 0.203: D3.3 119.04,91.95 R35.1 R36.2
N$75
  Top 0.203: C60.1 R51.1 121.7,100.46 R46.2 120.69,99.19 120.18,99.69 IC2.13
N$76
  Top 0.203: 123.44,102.58 121.41,102.58 R51.2 120.9,102.58 119.29,100.97 IC2.14 | 123.44,102.58 C60.2 | R52.2 123.44,103.97 123.44,102.58
N$77
  Top 0.203: D4.3 119.13,102.66 120.48,104.01 121.2,104.01 R52.1 121.45,104.39 123.15,106.09 R53.2
N$78  (via drill 0.35)
  Top 0.203: v173.99,107.95 153.67,107.95 152.91,107.19 U$2.93
  Bottom 0.203: JP3.2 173.99,88.9 v173.99,107.95
N$79  (via drill 0.35)
  Top 0.203: U$2.91 154.18,105.41 v173.23,105.41
  Bottom 0.203: v173.23,105.41 173.48,105.16 173.48,86.87 JP3.3
N$80  (via drill 0.35)
  Top 0.203: U$2.89 154.18,102.87 v172.85,102.87
  Bottom 0.203: v172.85,102.87 172.97,102.74 172.97,84.84 JP3.4
N$81  (via drill 0.35)
  Top 0.203: U$2.87 154.18,100.33 v172.34,100.33
  Bottom 0.203: v172.34,100.33 172.47,100.2 172.47,82.8 JP3.5
N$82  (via drill 0.35)
  Top 0.203: U$2.88 v170.16,99.06
  Bottom 0.203: v170.16,99.06 170.16,81.55 171.58,80.14 171.58,67.18 JP4.5
N$83  (via drill 0.35)
  Top 0.203: U$2.90 v170.49,101.6
  Bottom 0.203: v170.49,101.6 170.74,101.35 170.74,81.73 172.09,80.39 172.09,69.22 JP4.4
N$84  (via drill 0.35)
  Top 0.203: U$2.92 v171.07,104.14
  Bottom 0.203: v171.07,104.14 171.2,104.01 171.2,81.92 172.72,80.39 172.72,71.12 JP4.3
N$85  (via drill 0.35)
  Top 0.203: U$2.94 v171.45,106.68
  Bottom 0.203: JP4.2 173.61,72.77 173.61,80.26 171.7,82.17 171.7,106.43 v171.45,106.68
N$86  (1 unrouted)
N$87  (1 unrouted)
N$88  (1 unrouted)
N$89
  Top 0.203: JP1.1 4.57,92.71 37.12,92.71 39.88,95.47 39.88,98.77 CV4.P$3
N$90
  Top 0.203: JP1.5 8.1,105.41 CV1.P$3
N$91
  Top 0.203: JP1.4 18.57,102.87 CV2.P$3
N$92
  Top 0.203: JP1.2 6.22,93.6 25.02,93.6 27.31,95.89 27.31,98.94 33.62,105.25 CV3.P$3
N$214
  Top 0.203: R39.1 111.72,20.88 C13.2 111.81,22.14 R37.2 R38.1
N$215
  Top 0.203: R43.2 C13.1 109.93,22.14 R44.2 108.08,21.55 R45.1
N$216
  Top 0.203: IC1.9 113.41,29.08 111.72,27.39 C11.1 R43.1
N$217
  Top 0.203: IC1.10 114.68,27.9 C5.2 113.03,26.25 113.03,24.47 R37.1
N$220
  Top 0.203: IC1.7 112.14,38.06 C14.2 | C14.2 R42.2 | C14.2 R47.1
N$223
  Top 0.203: IC1.6 113.41,37.63 C14.1 R47.2 112.31,42.21 R50.1 R49.1
OLED_BLK  (via drill 0.35)  (3 unrouted)
  Top 0.203: v107.95,84.4 126.05,84.4 126.74,85.09 142.75,85.09 144.02,86.36 U$2.77
  Bottom 0.203: JP5.2 107.04,24.99 107.04,76.58 107.84,77.39 107.84,84.29 v107.95,84.4
OLED_CS  (via drill 0.35)  (3 unrouted)
  Top 0.203: U$2.75 145.03,83.82 143.76,82.55 v107.26,82.55
  Bottom 0.203: JP5.3 106.68,27.18 106.68,76.73 107.03,77.08 107.03,82.32 v107.26,82.55
OLED_DC  (via drill 0.35)  (3 unrouted)
  Top 0.203: v106.68,86.36 126.07,86.36 127.34,87.63 154.18,87.63 U$2.78
  Bottom 0.203: JP5.4 106.3,29.34 106.3,76.85 106.67,77.23 v106.67,86.35 v106.68,86.36
OLED_MOSI  (via drill 0.35)  (3 unrouted)
  Top 0.203: U$2.76 154.18,82.55 145.67,82.55 143.13,80.01 v105.74,80.01
  Bottom 0.203: JP5.6 105.51,33.63 105.51,79.78 v105.74,80.01
OLED_RST  (via drill 0.35)  (3 unrouted)
  Top 0.203: U$2.69 144.53,76.2 143.26,77.47 v106.09,77.47
  Bottom 0.203: JP5.5 105.87,31.45 105.87,77.24 v106.09,77.47
OLED_SCK  (via drill 0.35)  (3 unrouted)
  Top 0.203: v105.16,87.05 125.97,87.05 126.49,87.57 126.49,89.66 127,90.17 154.18,90.17 U$2.80
  Bottom 0.203: JP5.7 105.16,35.81 v105.16,87.05
OUT1  (via drill 0.35)
  Top 0.203: R104.1 160.62,76.2 v157.99,76.2 | JP9.4 177.8,101.09 177.8,100.46 175.77,98.42 v157.99,98.42
  Bottom 0.203: v157.99,98.42 v157.99,76.2
OUT2  (via drill 0.35)
  Top 0.203: R105.1 160.06,85.51 v160.15,85.6 | JP9.2 v160.15,97.79
  Bottom 0.203: v160.15,85.6 v160.15,97.79
OUT3  (via drill 0.35)
  Top 0.203: R98.1 108.08,28.83 111.51,32.26 124.46,32.26 v124.71,32
  Bottom 0.203: v124.71,32 124.71,29.21 126.24,27.69 126.24,26.8 JP6.3
OUT4  (via drill 0.35)
  Top 0.203: R99.1 125.01,27.9 v125.48,27.43
  Bottom 0.203: v125.48,27.43 125.48,25.02 JP6.2
OUT5  (via drill 0.35)
  Top 0.203: R100.1 133.22,28.07 137.41,32.26 v149.86,32.26
  Bottom 0.203: JP7.3 149.86,28.57 v149.86,32.26
OUT6  (via drill 0.35)
  Top 0.203: v150.27,26.58 150.02,26.83 150.02,27.46 149.33,28.16 R101.1
  Bottom 0.203: v150.27,26.58 150.27,25.62 JP7.2
OUT7  (via drill 0.35)
  Top 0.203: v173.99,31.75 162.56,31.75 158.88,28.07 R102.1
  Bottom 0.203: JP8.3 173.99,29.72 v173.99,31.75
OUT8
  Top 0.203: JP8.2 176.53,24.64 176.53,26.67 175.04,28.16 R103.1
SW1  (via drill 0.35)  (3 unrouted)
  Top 0.203: U$2.4 128.78,107.95 126.68,107.95 126.48,108.15 119.91,108.15 v119.55,107.78 | v119.38,53.34 112.52,53.34 JP5.11
  Bottom 0.203: v119.55,107.78 119.55,53.51 v119.38,53.34
SW2  (via drill 0.35)  (3 unrouted)
  Top 0.203: U$2.6 129.67,103.76 129.2,103.76 128.31,102.87 125.18,102.87 124.29,103.76 v124.21,103.76 | JP5.10 113.79,52.07 v122.43,52.07
  Bottom 0.203: v124.21,103.76 123.32,102.87 123.19,102.87 123.19,90.17 122.43,89.41 v122.43,52.07
SW3  (via drill 0.35)  (3 unrouted)
  Top 0.203: U$2.8 128.78,100.33 v125.04,100.33 | v124.97,50.8 114.81,50.8 103.63,39.62 JP5.9
  Bottom 0.203: v125.04,100.33 124.97,100.26 v124.97,50.8
SW4  (via drill 0.35)  (3 unrouted)
  Top 0.203: JP6.7 130.16,34.29 130.53,34.65 135.29,34.65 v135.31,34.67 | v135.31,96.47 130.1,96.47 U$2.12
  Bottom 0.203: v135.31,34.67 v135.31,96.47 135.25,96.52
SW5  (via drill 0.35)  (3 unrouted)
  Top 0.203: v149.86,95.25 128.78,95.25 U$2.11
  Bottom 0.203: JP7.7 152.4,36.2 152.4,45.47 149.99,47.88 149.99,73.03 149.86,73.15 v149.86,95.25
SW6  (via drill 0.35)  (3 unrouted)
  Top 0.203: v176.53,92.58 176.4,92.71 129.16,92.71 129.03,92.58 v128.91,92.58
  Bottom 0.203: JP8.7 177.16,36.7 177.16,73.03 178.69,74.55 178.69,90.42 v176.53,92.58 | v128.91,92.58 128.91,90.3 U$2.17
TR1  (via drill 0.35)
  Top 0.203: Q1.3 v132.08,37.08
  Bottom 0.203: v132.08,37.08 132.08,37.28 131.5,37.86 131.5,77.67 130.43,78.74 U$2.26
TR1_OUT  (2 unrouted)
  Top 0.203: R25.1 JP6.6
TR2  (via drill 0.35)
  Top 0.203: v157.73,37.08 157.48,36.83 Q2.3
  Bottom 0.203: U$2.83 154.18,92.71 155.96,92.71 156.72,91.95 156.72,60.83 157.48,60.07 157.48,37.34 v157.73,37.08
TR2_OUT  (2 unrouted)
  Top 0.203: R28.1 JP7.6
TR3  (via drill 0.35)
  Top 0.203: Q3.3 176.02,36.07 v175.01,37.08 | v175.01,52.07 v151.13,52.07
  Bottom 0.203: v175.01,52.07 v175.01,37.08 | U$2.81 151.13,89.66 v151.13,52.07
TR3_OUT  (2 unrouted)
  Top 0.203: R40.1 JP8.6